# Altium project isoUSBtoUART.PrjPcb
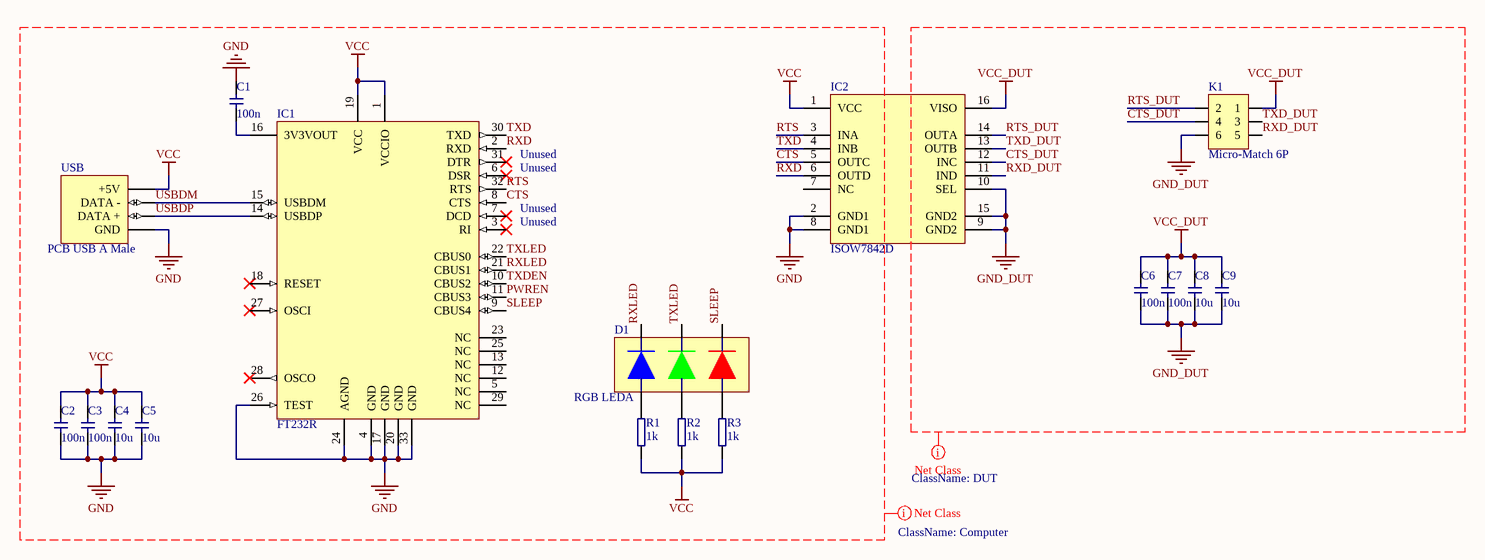
[diagram p0: isoUSBtoUART.SchDoc]
1 sheet, 17 parts. Net scope: global (net labels, ports and power ports of the same name join across sheets).
Board file: isoUSBtoUART.PcbDoc

## Sheet isoUSBtoUART.SchDoc
size A4

### Parts
C1  value 100n  [CAPC0402X06N]  (hidden comment: Capacitor)
C2  value 100n  [CAPC0402X06N]  (hidden comment: Capacitor)
C3  value 100n  [CAPC0402X06N]  (hidden comment: Capacitor)
C4  value 10u  [CAPC0402X06N]  (hidden comment: Capacitor)
C5  value 10u  [CAPC0402X06N]  (hidden comment: Capacitor)
C6  value 100n  [CAPC0402X06N]  (hidden comment: Capacitor)
C7  value 100n  [CAPC0402X06N]  (hidden comment: Capacitor)
C8  value 10u  [CAPC0402X06N]  (hidden comment: Capacitor)
C9  value 10u  [CAPC0402X06N]  (hidden comment: Capacitor)
D1  RGB LEDA  [PLCC6TRICOLLED]
IC1  FT232R  [QFN50P500X500X100_HS-33N]
IC2  ISOW7842D  [SOIC127P1030X265-16N_ISO]
K1  Micro-Match 6P  [MICRO_MATCH_6P_FEMALE]
R1  value 1k  [RESC0402X04L]  (hidden comment: Resistor)
R2  value 1k  [RESC0402X04L]  (hidden comment: Resistor)
R3  value 1k  [RESC0402X04L]  (hidden comment: Resistor)
USB  PCB USB A Male  [USB ON PCB]

### Nets
GND: C1.2 C2.1 C3.1 C4.1 C5.1 IC1.4(GND) IC1.17(GND) IC1.20(GND) IC1.24(AGND) IC1.26(TEST) IC1.33(GND) IC2.2(GND1) IC2.8(GND1) USB.4(GND)
GND_DUT: C6.1 C7.1 C8.1 C9.1 IC2.9(GND2) IC2.10(SEL) IC2.15(GND2) K1.6
VCC: C2.2 C3.2 C4.2 C5.2 IC1.1(VCCIO) IC1.19(VCC) IC2.1(VCC) R1.1 R2.1 R3.1 USB.1(+5V)
VCC_DUT: C6.2 C7.2 C8.2 C9.2 IC2.16(VISO) K1.1
CTS: IC1.8(CTS) IC2.5(OUTC)
CTS_DUT: IC2.12(INC) K1.4
PWREN: IC1.11(CBUS3)
RTS: IC1.32(RTS) IC2.3(INA)
RTS_DUT: IC2.14(OUTA) K1.2
RXD: IC1.2(RXD) IC2.6(OUTD)
RXD_DUT: IC2.11(IND) K1.5
RXLED: D1.1 IC1.21(CBUS1)
SLEEP: D1.3 IC1.9(CBUS4)
TXD: IC1.30(TXD) IC2.4(INB)
TXD_DUT: IC2.13(OUTB) K1.3
TXDEN: IC1.10(CBUS2)
TXLED: D1.2 IC1.22(CBUS0)
USBDM: IC1.15(USBDM) USB.2(DATA_-)
USBDP: IC1.14(USBDP) USB.3(DATA_+)
NetC1_1: C1.1 IC1.16(3V3VOUT)
NetD1_4: D1.4 R3.2
NetD1_5: D1.5 R2.2
NetD1_6: D1.6 R1.2

Not connected (* = marked no-connect by the designer): IC1 3(RI)* 5(NC) 6(DSR)* 7(DCD)* 12(NC) 13(NC) 18(RESET)* 23(NC) 25(NC) 27(OSCI)* 28(OSCO)* 29(NC) 31(DTR)*; IC2 7(NC)

### Layout directives
net class Computer: CTS, GND, PWREN, RTS, RXD, RXLED, SLEEP, TXD, TXDEN, TXLED, USBDM, USBDP, VCC
net class DUT: CTS_DUT, GND_DUT, RTS_DUT, RXD_DUT, TXD_DUT, VCC_DUT

### Notes on the sheet
- (near IC1) Unused

### Library data of the parts
D1 = RGB LEDA: RGB LED; Part-No: *; Vendor: *; Type: *; Link: *; Package: *; Product Code: *; Price: *
IC1 = FT232R: USB to USART controller; Price: *; Product Code: *; Part-No: *; Link: *; Package: *; Vendor: *
IC2 = ISOW7842D: High-Performance, 5000-VRMS Reinforced Quad-Channel Digital Isolators With  Integrated High-Efficiency, Low-Emissions DC-DC Converter; Part-No: *; Price: *; Link: *; Vendor: *; Manufacturer: *; Package: *; Product Code: *; Type: *; Value: *; Voltage: *; Current: *; Power: *; Frequency: *
K1 = Micro-Match 6P: 6 Pole Micro-Match connector; Link: *; Current: *; Voltage: *; Package: *; Part-No: *; Vendor: *; Product Code: *; Price: *
USB = PCB USB A Male: On PCB USB A male connector; Link: *; Package: *; Part-No: *; Price: *; Product Code: *; Type: *; Vendor: *
C1-C9 = Capacitor: Type: *; Vendor: *; Product Code: *; Voltage: *; Price: *; Link: *; ESR: *; Part-No: *; Package: *
R1-R3 = Resistor: Power: *; Part-No: *; Link: *; Price: *; Vendor: *; Voltage: *; Package: *; Product Code: *; Type: *